# EAGLE schematic amp_test_arm (EAGLE 7.6.0)
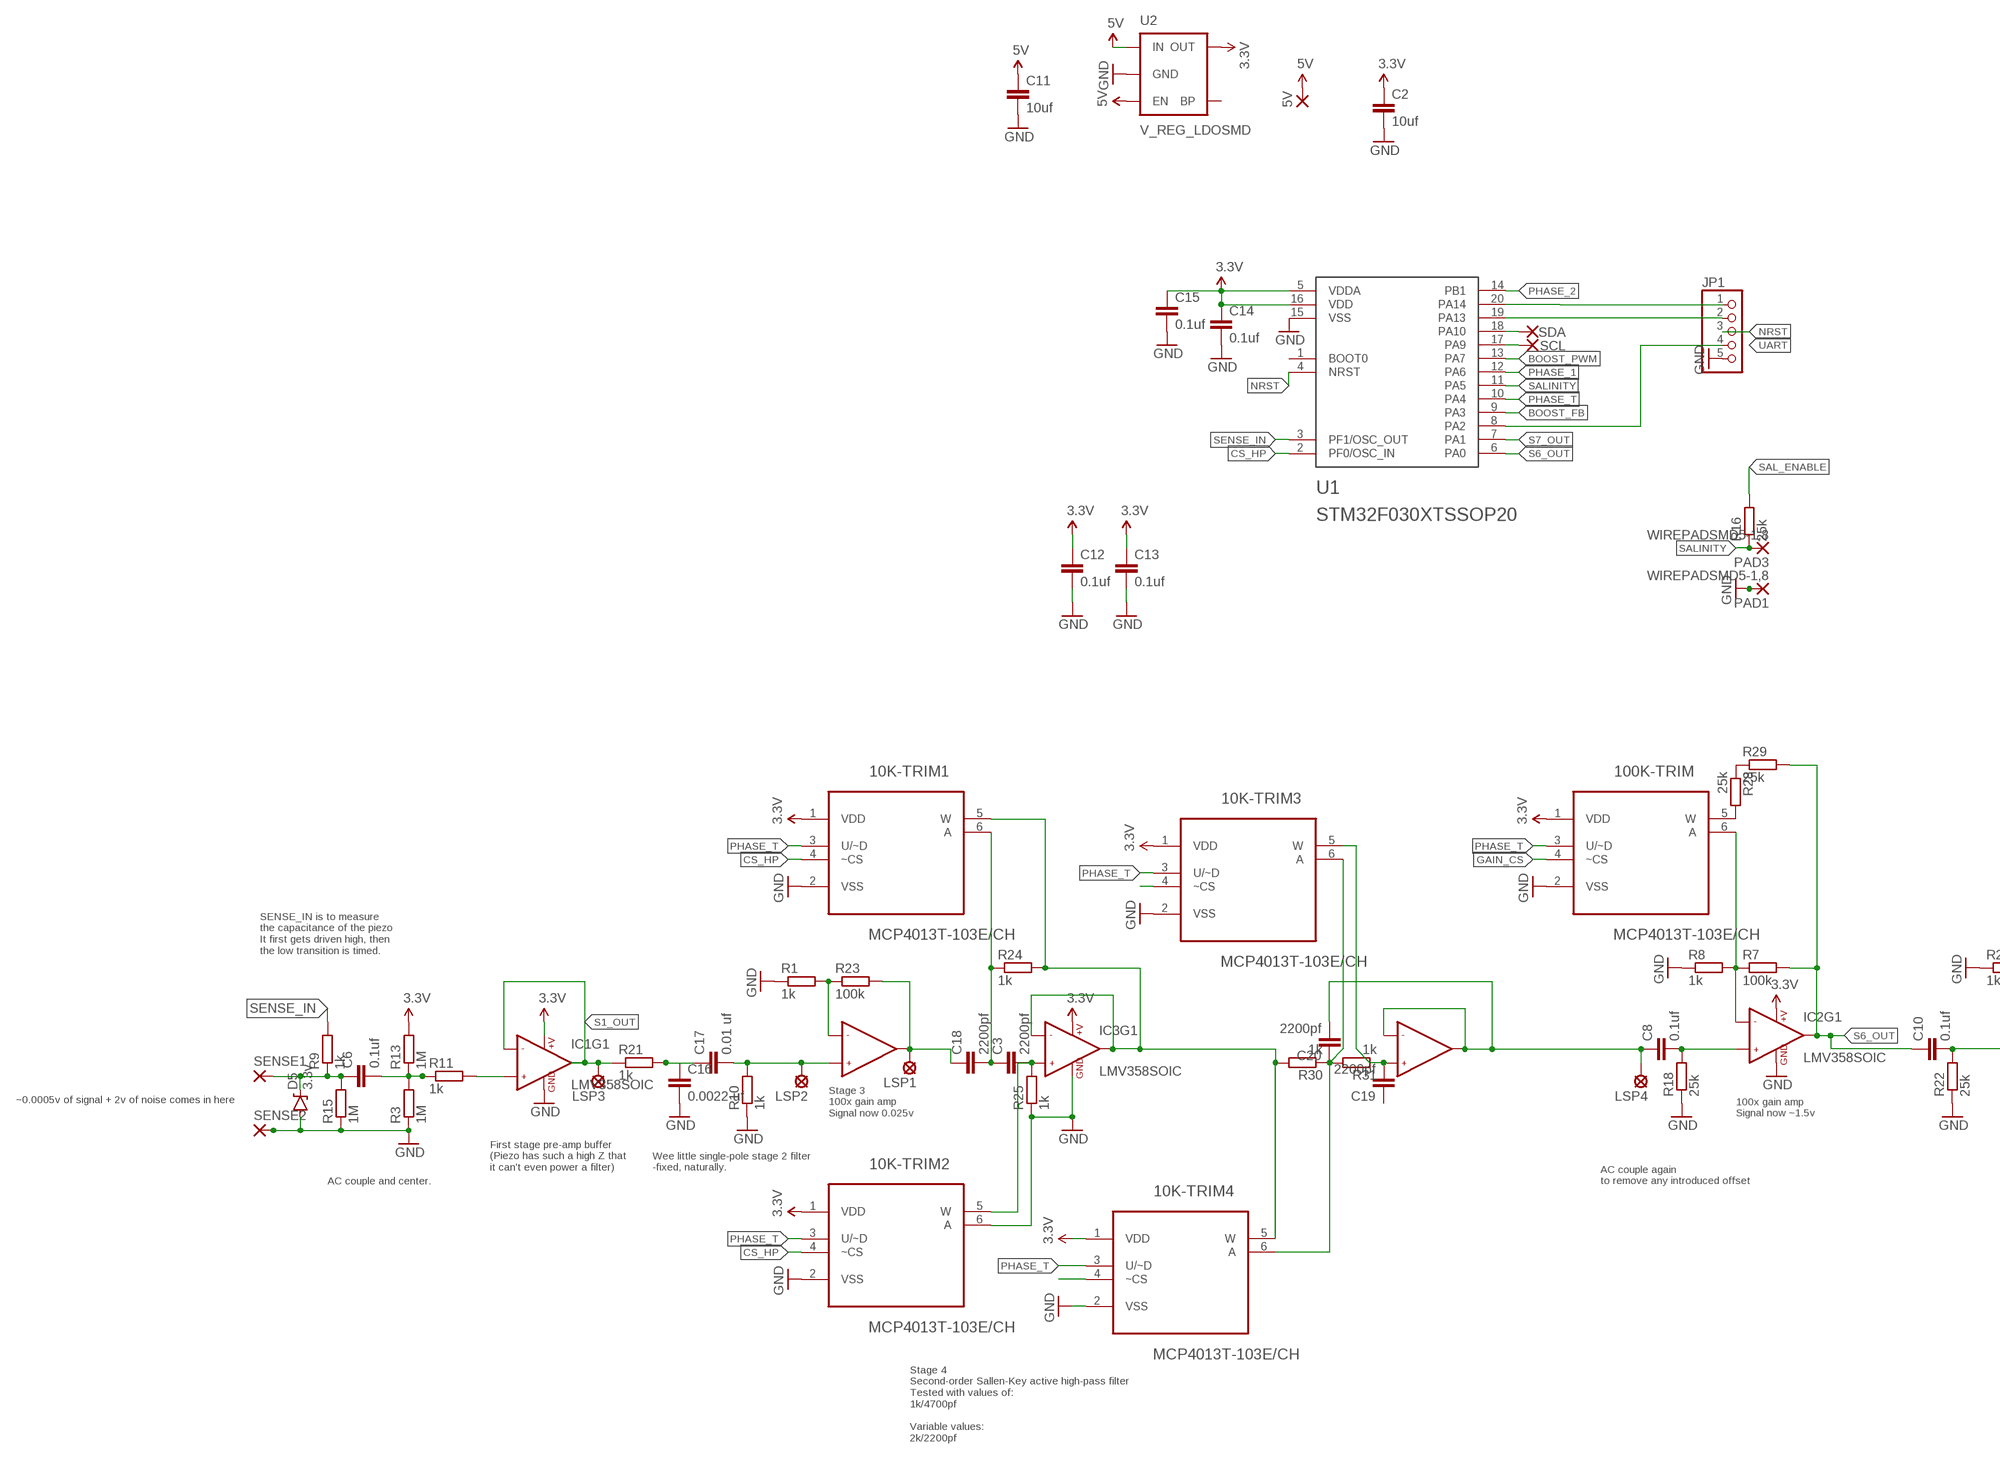
[diagram p0: schematic, sheet 1, part 1 of 2]
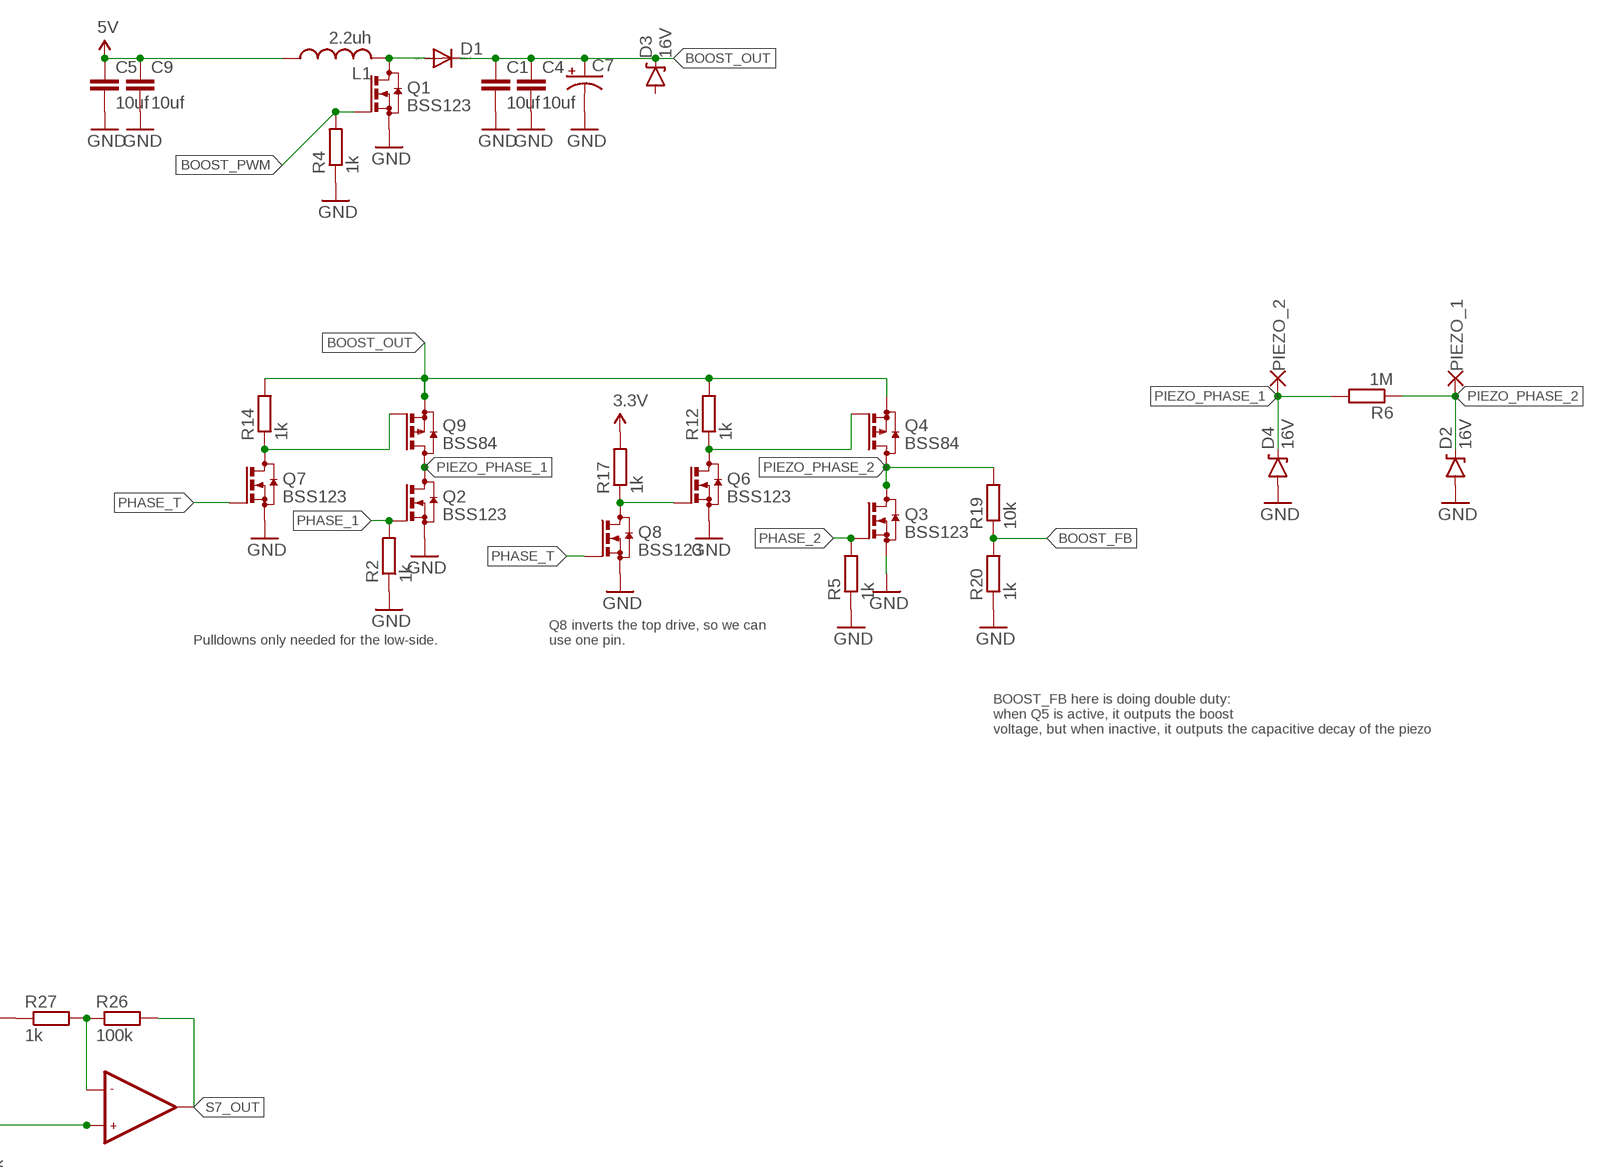
[diagram p1: schematic, sheet 1, part 2 of 2]

## Parts
5V  SMD5  [SMD2,54-5,08]
10K-TRIM1  MCP4013T-103E/CH  [SOT95P280X145-6N]
10K-TRIM2  MCP4013T-103E/CH  [SOT95P280X145-6N]
10K-TRIM3  MCP4013T-103E/CH  [SOT95P280X145-6N]
10K-TRIM4  MCP4013T-103E/CH  [SOT95P280X145-6N]
100K-TRIM  MCP4013T-103E/CH  [SOT95P280X145-6N]
C1  10uf  C-EUC0805  [C0805]
C2  10uf  C-EUC0603  [C0603]
C3  2200pf  C-EUC0603  [C0603]
C4  10uf  C-EUC0805  [C0805]
C5  10uf  C-EUC0603  [C0603]
C6  0.1uf  C-EUC0603  [C0603]
C7  CAP_POLPTH1  [CPOL-RADIAL-100UF-25V]
C8  0.1uf  C-EUC0603  [C0603]
C9  10uf  C-EUC0603  [C0603]
C10  0.1uf  C-EUC0603  [C0603]
C11  10uf  C-EUC0603  [C0603]
C12  0.1uf  C-EUC0603  [C0603]
C13  0.1uf  C-EUC0603  [C0603]
C14  0.1uf  C-EUC0603  [C0603]
C15  0.1uf  C-EUC0603  [C0603]
C16  0.0022 uf  C-EUC0603  [C0603]
C17  0.01 uf  C-EUC0603  [C0603]
C18  2200pf  C-EUC0603  [C0603]
C19  2200pf  C-EUC0603  [C0603]
C20  2200pf  C-EUC0603  [C0603]
D1  CGRM4001-G  [SOD-123_MINI-SMA]
D2  16V  DIODE-ZENER3.3V  [SOD-323]
D3  16V  DIODE-ZENER3.3V  [SOD-323]
D4  16V  DIODE-ZENER3.3V  [SOD-323]
D5  3.3v  DIODE-ZENER3.3V  [SOD-323]
IC1  LMV358SOIC  [SO08]
IC2  LMV358SOIC  [SO08]
IC3  LMV358SOIC  [SO08]
JP1  PINHD-1X5  [1X05]
L1  2.2uh  L-USL2825P  [L2825P]
LSP1  LSP10  [LSP10]
LSP2  LSP10  [LSP10]
LSP3  LSP10  [LSP10]
LSP4  LSP10  [LSP10]
PAD1  WIREPADSMD5-1,8  [5-1,8]
PAD3  WIREPADSMD5-1,8  [5-1,8]
PIEZO_1  SMD5  [SMD2,54-5,08]
PIEZO_2  SMD5  [SMD2,54-5,08]
Q1  BSS123  [SOT23]
Q2  BSS123  [SOT23]
Q3  BSS123  [SOT23]
Q4  BSS84  [SOT23]
Q6  BSS123  [SOT23]
Q7  BSS123  [SOT23]
Q8  BSS123  [SOT23]
Q9  BSS84  [SOT23]
R1  1k  R-EU_R0603  [R0603]
R2  1k  R-EU_R0603  [R0603]
R3  1M  R-EU_R0603  [R0603]
R4  1k  R-EU_R0603  [R0603]
R5  1k  R-EU_R0603  [R0603]
R6  1M  R-EU_R0603  [R0603]
R7  100k  R-EU_R0603  [R0603]
R8  1k  R-EU_R0603  [R0603]
R9  1k  R-EU_R0603  [R0603]
R10  1k  R-EU_R0603  [R0603]
R11  1k  R-EU_R0603  [R0603]
R12  1k  R-EU_R0603  [R0603]
R13  1M  R-EU_R0603  [R0603]
R14  1k  R-EU_R0603  [R0603]
R15  1M  R-EU_R0603  [R0603]
R16  25k  R-EU_R0603  [R0603]
R17  1k  R-EU_R0603  [R0603]
R18  25k  R-EU_R0603  [R0603]
R19  10k  R-EU_R0603  [R0603]
R20  1k  R-EU_R0603  [R0603]
R21  1k  R-EU_R0603  [R0603]
R22  25k  R-EU_R0603  [R0603]
R23  100k  R-EU_R0603  [R0603]
R24  1k  R-EU_R0603  [R0603]
R25  1k  R-EU_R0603  [R0603]
R26  100k  R-EU_R0603  [R0603]
R27  1k  R-EU_R0603  [R0603]
R28  25k  R-EU_R0603  [R0603]
R29  25k  R-EU_R0603  [R0603]
R30  1k  R-EU_R0603  [R0603]
R31  1k  R-EU_R0603  [R0603]
SCL  SMD5  [SMD2,54-5,08]
SDA  SMD5  [SMD2,54-5,08]
SENSE1  SMD5  [SMD2,54-5,08]
SENSE2  SMD5  [SMD2,54-5,08]
U1  STM32F030XTSSOP20  [TSSOP-20]
U2  V_REG_LDOSMD  [SOT23-5]

## Nets
3.3V: 10K-TRIM1.1(VDD) 10K-TRIM2.1(VDD) 10K-TRIM3.1(VDD) 10K-TRIM4.1(VDD) 100K-TRIM.1(VDD) C2.1 C12.1 C13.1 C14.1 C15.1 IC1.8(+V) IC2.8(+V) IC3.8(+V) R13.2 R17.2 U1.5(VDDA) U1.16(VDD) U2.5(OUT)
5V: 5V.1(P) C5.1 C9.1 C11.1 L1.1 U2.1(IN) U2.3(EN)
BOOST_FB: R19.1 R20.2 U1.9(PA3)
BOOST_OUT: C1.1 C4.1 C7.1(+) D1.C D3.C Q4.2(S) Q9.2(S) R12.2 R14.2
BOOST_PWM: Q1.1(G) R4.2 U1.13(PA7)
CS_HP: 10K-TRIM1.4(~CS) 10K-TRIM2.4(~CS) U1.2(PF0/OSC_IN)
GAIN_CS: 100K-TRIM.4(~CS)
GND: 10K-TRIM1.2(VSS) 10K-TRIM2.2(VSS) 10K-TRIM2.6(A) 10K-TRIM3.2(VSS) 10K-TRIM4.2(VSS) 100K-TRIM.2(VSS) C1.2 C2.2 C4.2 C5.2 C7.2(-) C9.2 C11.2 C12.2 C13.2 C14.2 C15.2 C16.2 D2.A D4.A D5.A IC1.4(GND) IC2.4(GND) IC3.4(GND) JP1.5 PAD1.1(P) Q1.2(S) Q2.2(S) Q3.2(S) Q6.2(S) Q7.2(S) Q8.2(S) R1.1 R2.1 R3.1 R4.1 R5.1 R8.1 R10.1 R15.1 R18.1 R20.1 R22.1 R25.1 R27.1 SENSE2.1(P) U1.15(VSS) U2.2(GND)
N$1: C10.2 IC2.5(+IN2) R22.2
N$2: Q4.1(G) Q6.3(D) R12.1
N$3: C8.1 C20.2 IC3.6(-IN2) IC3.7(OUT2) LSP4.MP
N$4: Q7.3(D) Q9.1(G) R14.1
N$5: Q6.1(G) Q8.3(D) R17.1
N$6: D1.A L1.2 Q1.3(D)
N$7: C6.2 R3.2 R11.1 R13.1
N$8: IC1.3(+IN1) R11.2
N$9: C16.1 C17.1 R21.2
N$10: JP1.2 U1.19(PA13)
N$11: IC1.6(-IN2) R1.2 R23.1
N$12: JP1.1 U1.20(PA14)
N$13: C17.2 IC1.5(+IN2) LSP2.MP R10.2
N$14: SDA.1(P) U1.18(PA10)
N$15: 100K-TRIM.6(A) IC2.2(-IN1) R7.1 R8.2
N$16: SCL.1(P) U1.17(PA9)
N$17: C18.1 IC1.7(OUT2) LSP1.MP R23.2
N$18: C8.2 IC2.3(+IN1) R18.2
N$19: 10K-TRIM3.5(W) C19.2 IC3.5(+IN2) R31.1
N$20: 10K-TRIM3.4(~CS)
N$21: 10K-TRIM2.5(W) C3.2 IC3.3(+IN1) R25.2
N$22: 10K-TRIM1.5(W) 10K-TRIM4.5(W) IC3.1(OUT1) IC3.2(-IN1) R24.2 R30.2
N$23: 10K-TRIM1.6(A) C3.1 C18.2 R24.1
N$24: 10K-TRIM4.4(~CS)
N$25: IC2.6(-IN2) R26.1 R27.2
N$26: 100K-TRIM.5(W) R28.2
N$27: R28.1 R29.1
N$28: 10K-TRIM3.6(A) 10K-TRIM4.6(A) C20.1 R30.1 R31.2
NRST: JP1.3 U1.4(NRST)
PHASE_1: Q2.1(G) R2.2 U1.12(PA6)
PHASE_2: Q3.1(G) R5.2 U1.14(PB1)
PHASE_T: 10K-TRIM1.3(U/~D) 10K-TRIM2.3(U/~D) 10K-TRIM3.3(U/~D) 10K-TRIM4.3(U/~D) 100K-TRIM.3(U/~D) Q7.1(G) Q8.1(G) U1.10(PA4)
PIEZO_PHASE_1: D4.C PIEZO_2.1(P) Q2.3(D) Q9.3(D) R6.2
PIEZO_PHASE_2: D2.C PIEZO_1.1(P) Q3.3(D) Q4.3(D) R6.1 R19.2
S1_OUT: IC1.1(OUT1) IC1.2(-IN1) LSP3.MP R21.1
S6_OUT: C10.1 IC2.1(OUT1) R7.2 R29.2 U1.6(PA0)
S7_OUT: IC2.7(OUT2) R26.2 U1.7(PA1)
SAL_ENABLE: R16.2
SALINITY: PAD3.1(P) R16.1 U1.11(PA5)
SENSE_IN: C6.1 D5.C R9.1 R9.2 R15.2 SENSE1.1(P) U1.3(PF1/OSC_OUT)
UART: JP1.4 U1.8(PA2)
Unconnected: C19.1 D3.A U1.1(BOOT0) U2.4(BP)

## Notes on the sheet
- Pulldowns only needed for the low-side.
- Q8 inverts the top drive, so we can 
  use one pin.
- BOOST_FB here is doing double duty:
  when Q5 is active, it outputs the boost
  voltage, but when inactive, it outputs the capacitive decay of the piezo
- SENSE_IN is to measure
  the capacitance of the piezo
  It first gets driven high, then 
  the low transition is timed.
- ~0.0005v of signal + 2v of noise comes in here
- Stage 3
  100x gain amp
  Signal now 0.025v
- 100x gain amp
  Signal now ~1.5v
- First stage pre-amp buffer
  (Piezo has such a high Z that 
  it can't even power a filter)
- Wee little single-pole stage 2 filter
  -fixed, naturally.
- AC couple and center.
- AC couple again
  to remove any introduced offset
- Stage 4
  Second-order Sallen-Key active high-pass filter
  Tested with values of:
  1k/4700pf
  
  Variable values: 
  2k/2200pf

## Library data of the parts
5V PIEZO_1 PIEZO_2 SCL SDA SENSE1 SENSE2 = wirepad:SMD5: SMD PAD
10K-TRIM1-10K-TRIM4 100K-TRIM = MCP4013T-103E_CH:MCP4013T-103E/CH: Digital POT; DESCRIPTION: Digital Potentiometers with SPI Interface 10k, U/D single, 6-bit V, POT to GND; DIGI-KEY_PART_NUMBER: MCP4013T-103E/CHCT-ND; DIGI-KEY_PURCHASE_URL: https://www.digikey.ca/product-detail/en/microchip-technology/MCP4013T-103E-CH/MCP4013T-103E-CHCT-ND/1015697?WT.z_cid=ref_snapeda&utm_source=snapeda&utm_medium=aggregator&utm_campaign=buynow; MF: Microchip; MP: MCP4013T-103E/CH; PACKAGE: SOT-23-6 Microchip
C1-C6 C8-C20 = rcl:C-EU: CAPACITOR, European symbol
C7 = SparkFun-Capacitors:CAP_POL: Capacitor Polarized These are standard SMD and PTH capacitors. Normally 10uF, 47uF, and 100uF in electrolytic and tantalum varieties. Always verify the external diameter of the through hole cap, it varies with capacity, voltage, and manufacturer. The EIA devices should be standard.
D1 = diode:CGRM400*-G: Molded plasitc,JEDEC SOD-123/Mini SMA Source: Comchip CGRM4001-G.pdf
D2-D5 = SparkFun-DiscreteSemi:DIODE-ZENER: Zener Diode Production Part - 8199 3.4V Zener Voltage; PROD_ID: DIO-11284; VALUE: 3.3V
IC1-IC3 = SparkFun-AnalogIC:LMV358: Jellybean rail-to-rail output op-amp; PROD_ID: IC-09657
JP1 = pinhead:PINHD-1X5: PIN HEADER
L1 = rcl:L-US: INDUCTOR, American symbol
LSP1-LSP4 = solpad:LSP10: SOLDER PAD drill 1.0 mm, distributor Buerklin, 12H555
PAD1 PAD3 = wirepad:WIREPAD: Wire PAD connect wire on PCB
Q1-Q3 Q6-Q8 = transistor-small-signal:BSS123: N-CHANNEL MOS FET
Q4 Q9 = transistor-small-signal:BSS84: P-CHANNEL MOS FET
R1-R31 = rcl:R-EU_: RESISTOR, European symbol
U1 = stm32f030x:STM32F030X
U2 = SparkFun-PowerIC:V_REG_LDO: Voltage Regulator LDO Standard 150mA LDO voltage regulator in SOT-23 layout. Micrel part MIC5205. BP (by-pass) pin is used to lower output noise with 470pF cap.

## Net classes
0 default: width 0.635 mm, drill 0.508 mm